# EAGLE design POGOTEST-MK2RP2040 (EAGLE 9.6.2)
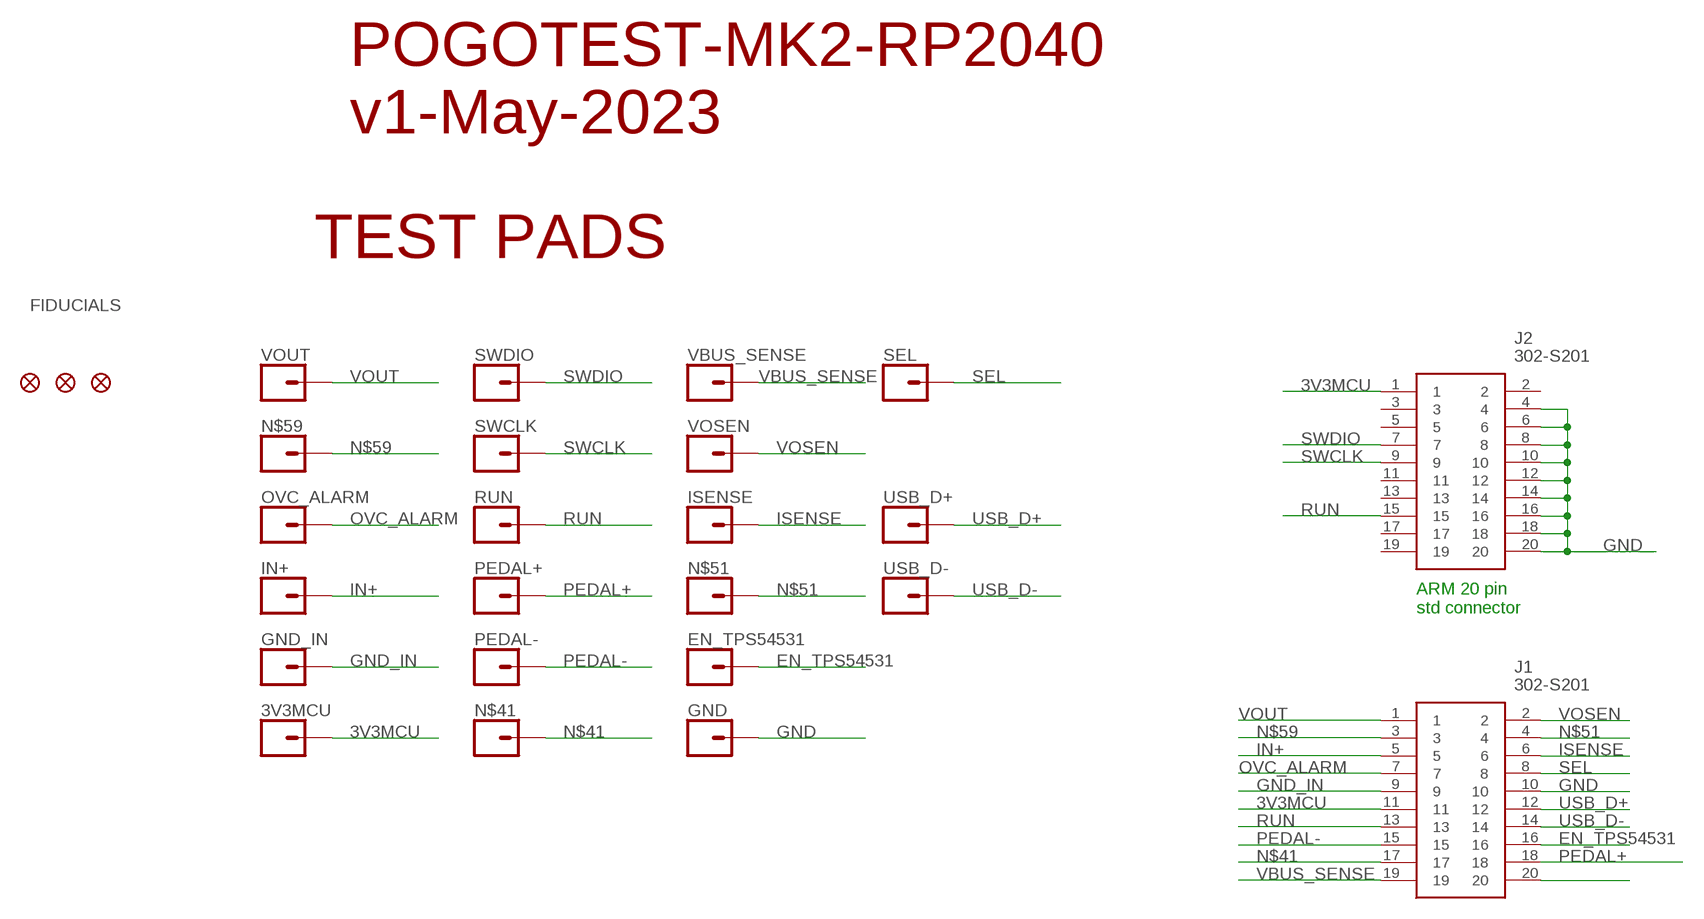
[diagram p0: schematic, sheet 1]

## Parts
3V3MCU  CONN_01POGOPIN_HOLE_LARGE  [1X01_POGOPIN_HOLE_0.061_DIA]
EN_TPS54531  CONN_01POGOPIN_HOLE_LARGE  [1X01_POGOPIN_HOLE_0.061_DIA]
FID3  FIDUCIAL1X2  [FIDUCIAL-1X2]
FID5  FIDUCIAL1X2  [FIDUCIAL-1X2]
FID6  FIDUCIAL1X2  [FIDUCIAL-1X2]
GND  CONN_01POGOPIN_HOLE_LARGE  [1X01_POGOPIN_HOLE_0.061_DIA]
GND_IN  CONN_01POGOPIN_HOLE_LARGE  [1X01_POGOPIN_HOLE_0.061_DIA]
IN+  CONN_01POGOPIN_HOLE_LARGE  [1X01_POGOPIN_HOLE_0.061_DIA]
ISENSE  CONN_01POGOPIN_HOLE_LARGE  [1X01_POGOPIN_HOLE_0.061_DIA]
J1  302-S201  [SHDR20W66P254_2X10_3300X905X90]
J2  302-S201  [SHDR20W66P254_2X10_3300X905X90]
N$41  CONN_01POGOPIN_HOLE_LARGE  [1X01_POGOPIN_HOLE_0.061_DIA]
N$51  CONN_01POGOPIN_HOLE_LARGE  [1X01_POGOPIN_HOLE_0.061_DIA]
N$59  CONN_01POGOPIN_HOLE_LARGE  [1X01_POGOPIN_HOLE_0.061_DIA]
OVC_ALARM  CONN_01POGOPIN_HOLE_LARGE  [1X01_POGOPIN_HOLE_0.061_DIA]
PEDAL+  CONN_01POGOPIN_HOLE_LARGE  [1X01_POGOPIN_HOLE_0.061_DIA]
PEDAL-  CONN_01POGOPIN_HOLE_LARGE  [1X01_POGOPIN_HOLE_0.061_DIA]
RUN  CONN_01POGOPIN_HOLE_LARGE  [1X01_POGOPIN_HOLE_0.061_DIA]
SEL  CONN_01POGOPIN_HOLE_LARGE  [1X01_POGOPIN_HOLE_0.061_DIA]
SWCLK  CONN_01POGOPIN_HOLE_LARGE  [1X01_POGOPIN_HOLE_0.061_DIA]
SWDIO  CONN_01POGOPIN_HOLE_LARGE  [1X01_POGOPIN_HOLE_0.061_DIA]
USB_D+  CONN_01POGOPIN_HOLE_LARGE  [1X01_POGOPIN_HOLE_0.061_DIA]
USB_D-  CONN_01POGOPIN_HOLE_LARGE  [1X01_POGOPIN_HOLE_0.061_DIA]
VBUS_SENSE  CONN_01POGOPIN_HOLE_LARGE  [1X01_POGOPIN_HOLE_0.061_DIA]
VOSEN  CONN_01POGOPIN_HOLE_LARGE  [1X01_POGOPIN_HOLE_0.061_DIA]
VOUT  CONN_01POGOPIN_HOLE_LARGE  [1X01_POGOPIN_HOLE_0.061_DIA]

## Nets
3V3MCU: 3V3MCU.2 J1.11 J2.1
EN_TPS54531: EN_TPS54531.2 J1.16
GND: GND.2 J1.10 J2.4 J2.6 J2.8 J2.10 J2.12 J2.14 J2.16 J2.18 J2.20
GND_IN: GND_IN.2 J1.9
IN+: IN+.2 J1.5
ISENSE: ISENSE.2 J1.6
N$20: J1.20
N$41: J1.17 N$41.2
N$51: J1.4 N$51.2
N$59: J1.3 N$59.2
OVC_ALARM: J1.7 OVC_ALARM.2
PEDAL+: J1.18 PEDAL+.2
PEDAL-: J1.15 PEDAL-.2
RUN: J1.13 J2.15 RUN.2
SEL: J1.8 SEL.2
SWCLK: J2.9 SWCLK.2
SWDIO: J2.7 SWDIO.2
USB_D+: J1.12 USB_D+.2
USB_D-: J1.14 USB_D-.2
VBUS_SENSE: J1.19 VBUS_SENSE.2
VOSEN: J1.2 VOSEN.2
VOUT: J1.1 VOUT.2
Unconnected: J2.2 J2.3 J2.5 J2.11 J2.13 J2.17 J2.19

## Notes on the sheet
- POGOTEST-MK2-RP2040
  v1-May-2023
- TEST PADS
- FIDUCIALS
- ARM 20 pin
  std connector

## Library data of the parts
3V3MCU EN_TPS54531 GND GND_IN IN+ ISENSE N$41 N$51 N$59 OVC_ALARM PEDAL+ PEDAL- RUN SEL SWCLK SWDIO USB_D+ USB_D- VBUS_SENSE VOSEN VOUT = SparkFun-Connectors:CONN_01: Single connection point. Often used as Generic Header-pin footprint for 0.1 inch spaced/style header connections On any of the 0.1 inch spaced packages, you can populate with these: Break Away Headers - Straight <https://www.sparkfun.com/products/116> (PRT-00116) Break Away Male Headers - Right Angle <https://www.sparkfun.com/products/553> (PRT-00553) Female Headers <https://www.sparkfun.com/products/115> (PRT-00115) Break Away Headers - Machine Pin <https://www.sparkfun.com/products/117> (PRT-00117) Break Away Female Headers - Swiss Machine Pin <https://www.sparkfun.com/products/743> (PRT-00743) This device is also useful as a general connection point to wire up your design to another part of your project. Our various solder wires solder well into these plated through hole pads. Hook-Up Wire - Assortment (Stranded, 22 AWG) <https://www.sparkfun.com/products/11375> (PRT-11375) Hook-Up Wire - Assortment (Solid Core, 22 AWG) <https://www.sparkfun.com/products/11367> (PRT-11367) View the entire wire category on our website here <https://www.sparkfun.com/categories/141> Special notes: SMTSO-256-ET is a "flush mount" nut for a 4-40 screw. We mostly use this on specialty testbeds; it is a nice way to connect hardware to your PCB at an adjustable hieght. Also note, the SNAP packages are for using a snappable style connector. We sell a baggie of snaps and they are also used on two LilyPad designs: Snap Assortment - 30 pack (male and female) <https://www.sparkfun.com/products/11347> (DEV-11347) LilyPad Arduino SimpleSnap <https://www.sparkfun.com/products/10941> (DEV-10941) LilyPad SimpleSnap Protoboard <https://www.sparkfun.com/products/10940> (DEV-10940)
FID3 FID5 FID6 = SparkFun-Aesthetics:FIDUCIAL: Fiducial Alignment Points Various fiducial points for machine vision alignment.
J1 J2 = 302-S201:302-S201: CONN HEADER VERT 20POS GOLD Source: Datasheet <http://www.on-shore.com/wp-content/uploads/2018/04/302-SXX1.pdf>; DESCRIPTION: CONN HEADER VERT 20POS GOLD; HEIGHT: 9.05mm; MANUFACTURER_NAME: On Shore Technology Inc.; MANUFACTURER_PART_NUMBER: 302-S201

## Net classes
1 vcc: width 0.254 mm

## Board
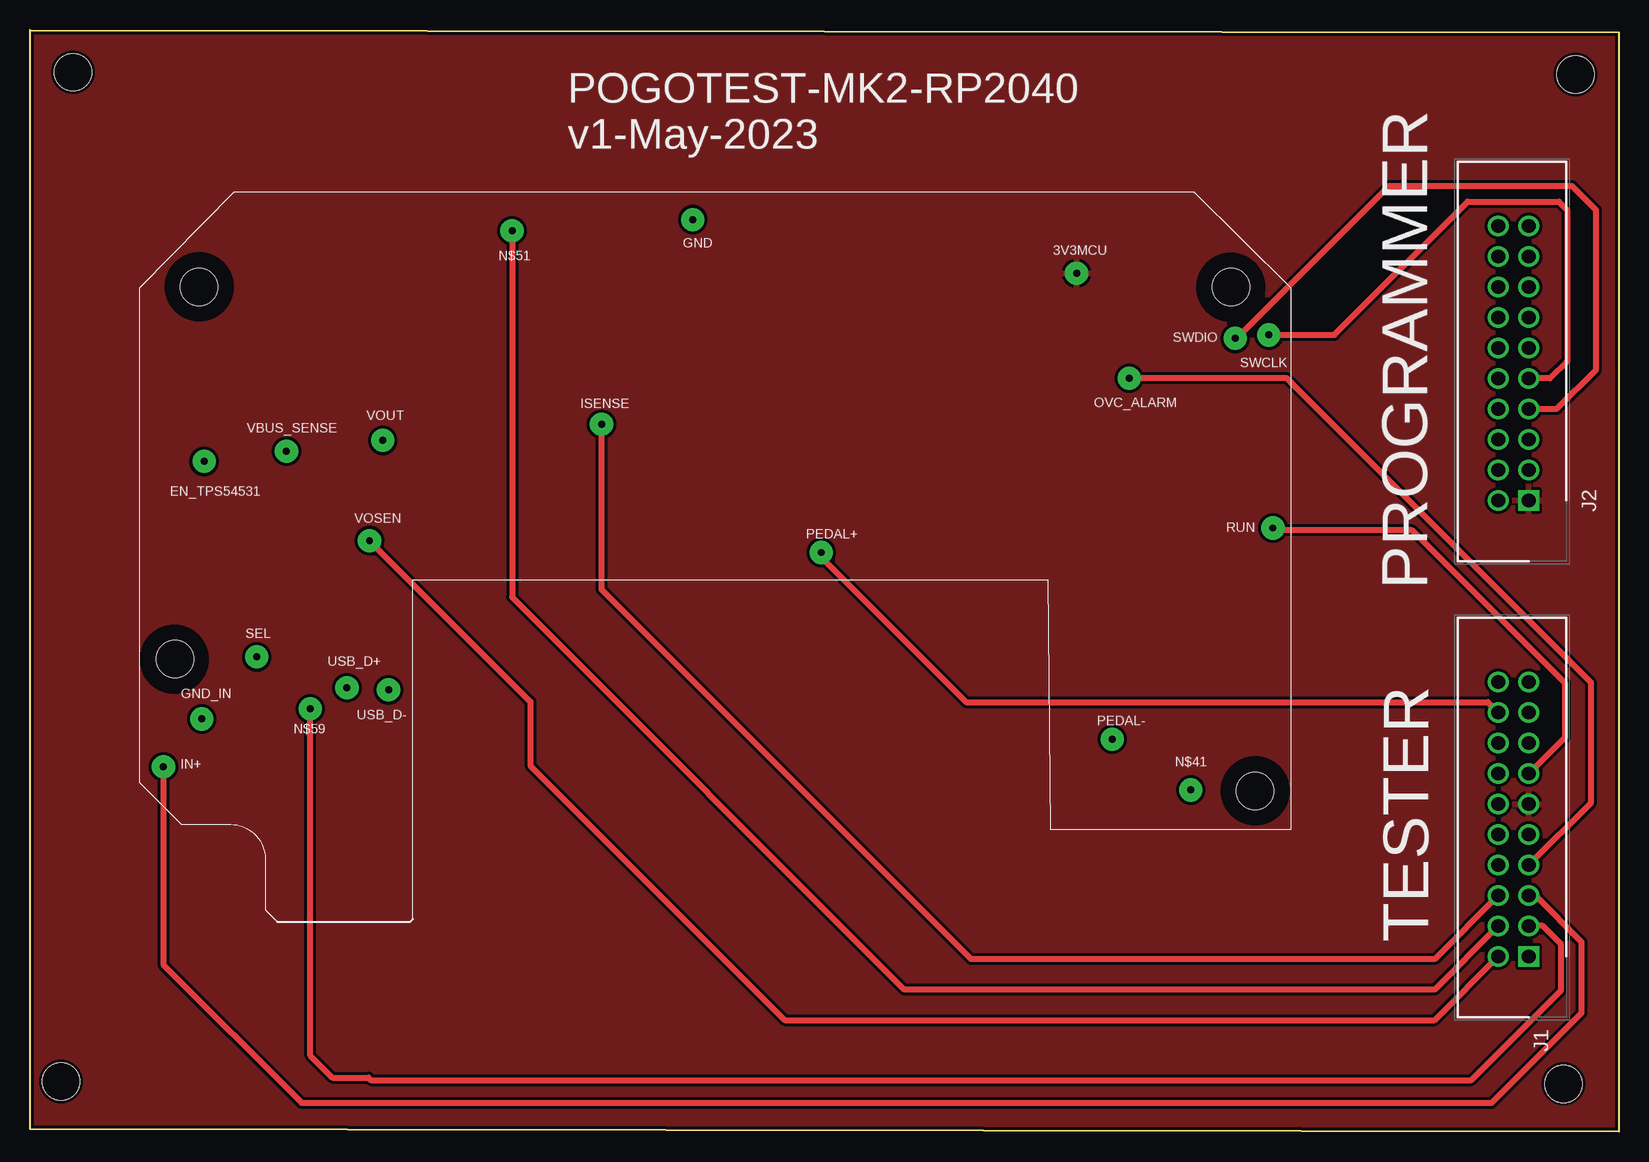
[diagram p1: board, top side]
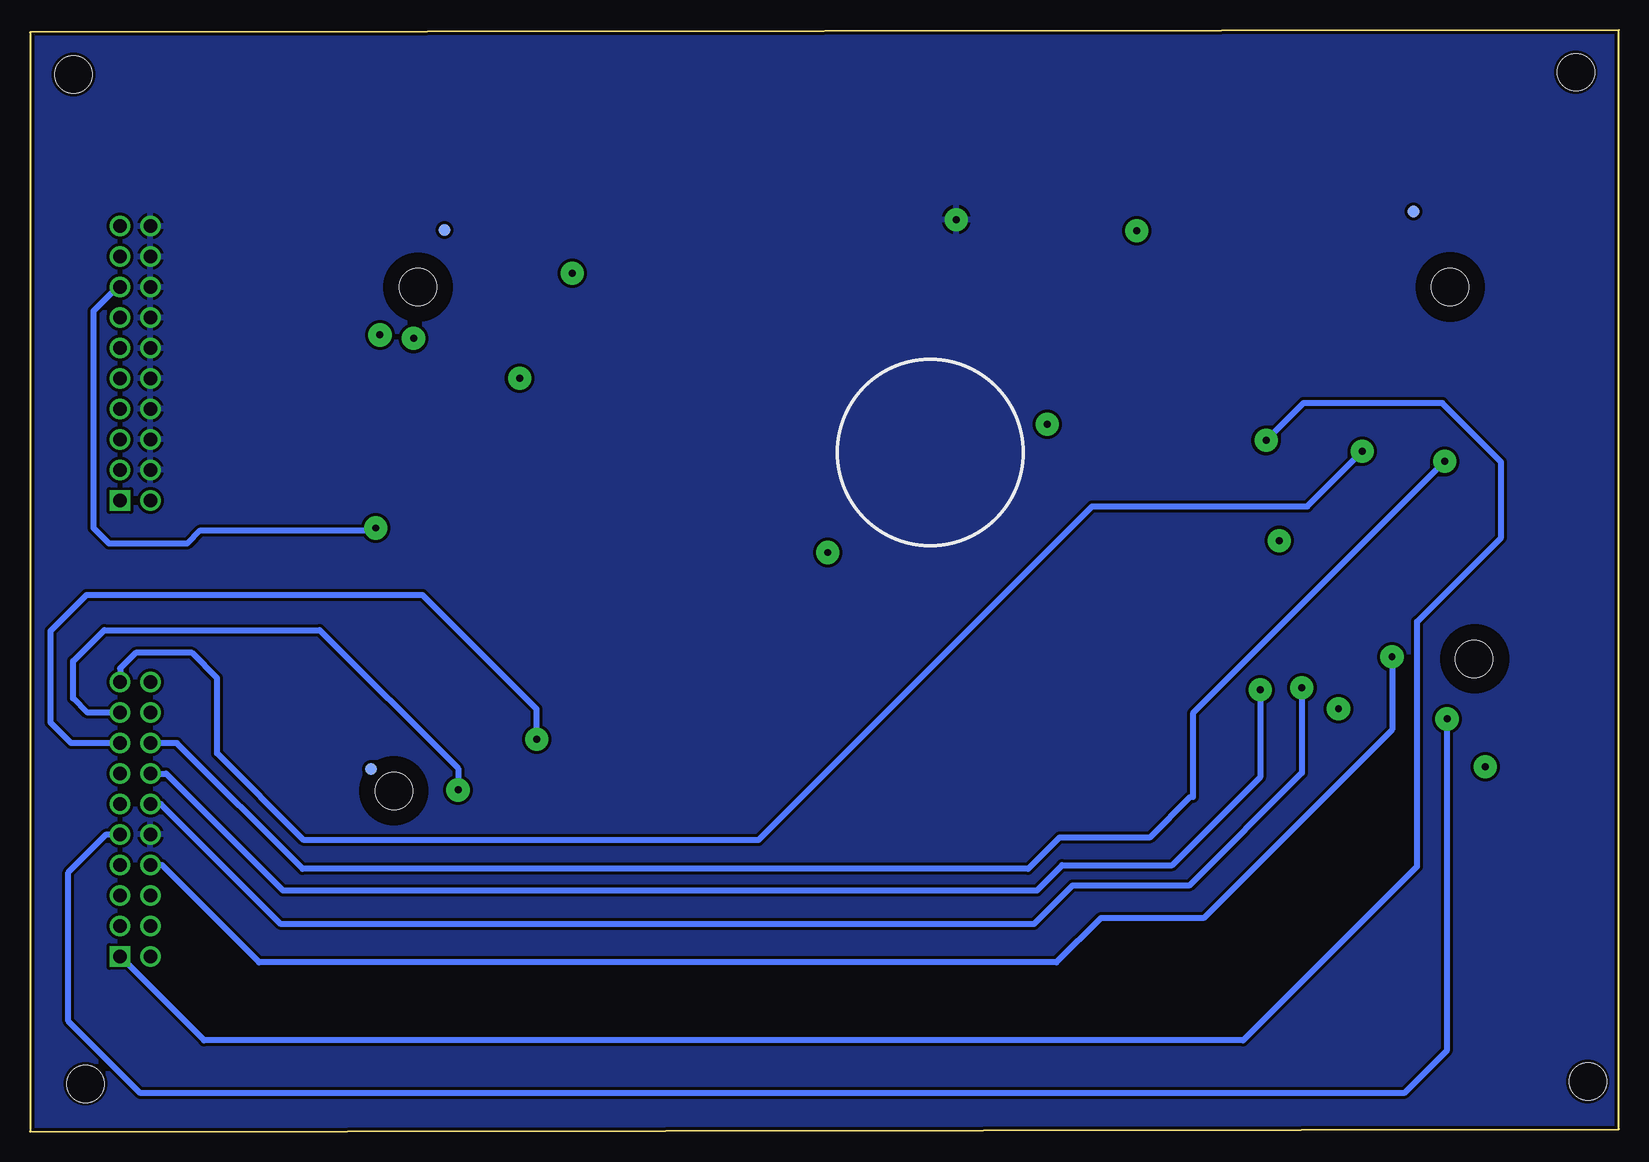
[diagram p2: board, bottom side, seen from below]

Size 132.4 x 91.8 mm. Coordinates in mm from the lower left corner, seen from the top.
Outline: 0,91.8 132.4,91.6 132.4,0 0,0.2 0,91.8
Copper layers (1*16): Top 0.035mm / dielectric 0.2mm / Bottom 0.035mm
Design rules "SeeedStudio_4layer_DRU_no_angle_20140221 *": minimum track width 8mil, minimum drill 12mil, track to track 8mil, track to pad 8mil, pad to pad 8mil, via to via 8mil, smd to smd 0mil, copper to edge 10mil, drill to drill 8mil, minimum pad ring 6mil, minimum via ring 4mil, stop-mask expansion 4mil, vias tented up to drill 25mil, thermal gap 10mil
Holes 3.1 mm at 14.08,70.38 100.08,70.38 12.08,39.38 102.08,28.38 3.58,88.28 2.58,4.18 127.78,3.98 128.78,88.08
tRestrict: area 99.6,25.9 to 104.6,30.9; area 97.6,67.9 to 102.6,72.9; area 9.5,36.9 to 14.5,41.9; area 11.6,67.9 to 16.6,72.9
bRestrict: area 11.6,67.9 to 16.6,72.9; area 97.6,67.9 to 102.6,72.9; area 99.6,25.9 to 104.6,30.9; area 9.5,36.9 to 14.5,41.9

### Footprints (pad centres in the part's own frame; a part is rotated, then mirrored left to right if it is on the bottom)
1X01_POGOPIN_HOLE_0.061_DIA = drill 0.58 pad 1.93: 2 0,0
FIDUCIAL-1X2 = smd 1 x 1: 1 0,0
SHDR20W66P254_2X10_3300X905X90 = drill 1.15 pad 1.725 square: 1 0,0 | drill 1.15 pad 1.725: 2 0,2.54; 3 2.54,0; 4 2.54,2.54; 5 5.08,0; 6 5.08,2.54; 7 7.62,0; 8 7.62,2.54; 9 10.16,0; 10 10.16,2.54; 11 12.7,0; 12 12.7,2.54; 13 15.24,0; 14 15.24,2.54; 15 17.78,0; 16 17.78,2.54; 17 20.32,0; 18 20.32,2.54; 19 22.86,0; 20 22.86,2.54

### Placement (x,y rotation side)
3V3MCU  87.21,71.52 0 top
EN_TPS54531  14.51,55.85 0 top
FID3  17.13,76.69 0 bottom
FID5  97.86,75.14 0 bottom
FID6  104,30.2 0 bottom
GND  55.22,76 0 top
GND_IN  14.31,34.39 0 top
IN+  11.12,30.41 0 top
ISENSE  47.63,58.94 0 top
J1  124.9,14.6 90 top
J2  124.9,52.6 90 top
N$41  96.73,28.47 0 top
N$51  40.17,75.07 0 top
N$59  23.36,35.23 0 top
OVC_ALARM  91.6,62.78 0 top
PEDAL+  65.93,48.26 0 top
PEDAL-  90.18,32.7 0 top
RUN  103.58,50.3 0 top
SEL  18.9,39.56 0 top
SWCLK  103.24,66.39 0 top
SWDIO  100.44,66.1 0 top
USB_D+  26.41,36.98 0 top
USB_D-  29.88,36.81 0 top
VBUS_SENSE  21.37,56.69 0 top
VOSEN  28.29,49.25 0 top
VOUT  29.39,57.6 0 top

### Tracks (layer width: path | path; a pad name or v marks a point on that pad's centre or on a via)
3V3MCU
  pour Top (isolate 0.254): -5.9,96.2 0.5,96.2 138.3,96.3 138.3,-6.6 -5.9,-6.4
EN_TPS54531
  Bottom 0.508: EN_TPS54531.2 35.5,34.86 35.5,27.9 35.7,27.9 39.1,24.5 46.62,24.5 49.22,21.9 109.68,21.9 120.16,32.38 J1.16
GND
  pour Bottom (isolate 0.254): -7.7,96.1 138.4,96.1 138.4,-6.8 -7.7,-6.6
GND_IN
  Bottom 0.508: GND_IN.2 14.31,6.79 17.9,3.2 123.2,3.2 129.2,9.2 129.2,21.6 126.04,24.76 J1.9
IN+
  Top 0.508: IN+.2 11.12,13.91 22.63,2.4 121.8,2.4 129.3,9.9 129.3,15.8 125.42,19.68 J1.5
ISENSE
  Top 0.508: ISENSE.2 47.63,45.17 78.42,14.38 117.06,14.38 J1.6
N$41
  Bottom 0.508: J1.17 127.62,34.92 128.8,36.1 128.8,39.2 126.2,41.8 108.26,41.8 96.73,30.27 N$41.2
N$51
  Top 0.508: N$51.2 40.17,44.53 72.86,11.84 117.06,11.84 J1.4
N$59
  Top 0.508: N$59.2 23.36,6.34 25.2,4.5 28.2,4.5 28.4,4.3 120.1,4.3 127.6,11.8 127.6,15.6 126.06,17.14 J1.3
OVC_ALARM
  Top 0.508: OVC_ALARM.2 104.72,62.78 130.1,37.4 130.1,27.42 J1.7
PEDAL+
  Top 0.508: PEDAL+.2 65.93,47.87 78,35.8 121.48,35.8 J1.18
PEDAL-
  Bottom 0.508: J1.15 128.98,32.38 130.7,34.1 130.7,41.7 127.7,44.7 99.68,44.7 90.18,35.2 PEDAL-.2
RUN
  Top 0.508: RUN.2 103.78,50.1 115.2,50.1 127.9,37.4 127.9,32.84 J1.13
  Bottom 0.508: RUN.2 103.78,50.1 118.2,50.1 119.3,49 125.8,49 127.1,50.3 127.1,68.4 125.12,70.38 J2.15
SEL
  Bottom 0.508: SEL.2 18.9,33.5 34.6,17.8 43.16,17.8 46.86,14.1 113.3,14.1 121.42,22.22 J1.8
SWCLK
  Top 0.508: J2.9 126.66,62.76 128.1,64.2 128.1,76.8 127.4,77.5 119.8,77.5 108.69,66.39 SWCLK.2
SWDIO
  Top 0.508: J2.7 127.22,60.22 130.5,63.5 130.5,76.8 128.5,78.8 113.24,78.8 100.49,66.05 SWDIO.2
USB_D+
  Bottom 0.508: USB_D+.2 26.41,29.89 35.8,20.5 45.54,20.5 48.74,17.3 111.5,17.3 121.5,27.3 J1.12
USB_D-
  Bottom 0.508: USB_D-.2 29.88,29.52 37.2,22.2 46.38,22.2 48.48,20.1 111.32,20.1 121.06,29.84 J1.14
VBUS_SENSE
  Bottom 0.508: VBUS_SENSE.2 25.96,52.1 43.9,52.1 71.7,24.3 109.58,24.3 116.8,31.52 116.8,37.8 118.9,39.9 123.6,39.9 124.9,38.6 J1.19
VOSEN
  Top 0.508: VOSEN.2 41.7,35.84 41.7,30.5 62.9,9.3 117.06,9.3 J1.2
VOUT
  Bottom 0.508: VOUT.2 26.29,60.7 14.7,60.7 9.8,55.8 9.8,49.5 16.8,42.5 16.8,22.1 31.3,7.6 117.9,7.6 J1.1

### Text on the board
tPlace: PROGRAMMER | TESTER
tNames: POGOTEST-MK2-RP2040 / v1-May-2023